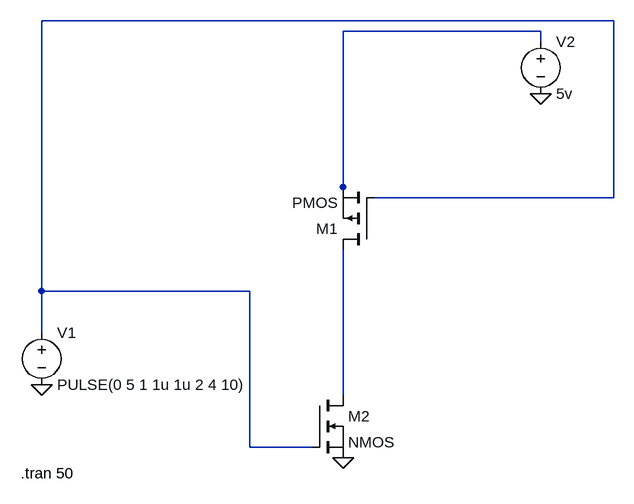
[diagram p0: schematic Cmoc_invert.asc]
Cmoc_invert.asc, the LTspice schematic file:
Version 4
SHEET 1 880 680
WIRE 400 -144 -480 -144
WIRE 288 -128 -16 -128
WIRE 288 -112 288 -128
WIRE -16 112 -16 -128
WIRE -16 128 -16 112
WIRE 400 128 400 -144
WIRE 400 128 32 128
WIRE -480 272 -480 -144
WIRE -160 272 -480 272
WIRE -480 336 -480 272
WIRE -16 432 -16 208
WIRE -160 512 -160 272
WIRE -64 512 -160 512
FLAG -480 416 0
FLAG 288 -32 0
FLAG -16 528 0
SYMBOL nmos -64 432 R0
SYMATTR InstName M2
SYMBOL voltage -480 320 R0
WINDOW 123 0 0 Left 0
WINDOW 39 0 0 Left 0
SYMATTR InstName V1
SYMATTR Value PULSE(0 5 1 1u 1u 2 4 10)
SYMBOL voltage 288 -128 R0
WINDOW 123 0 0 Left 0
WINDOW 39 0 0 Left 0
SYMATTR InstName V2
SYMATTR Value 5v
SYMBOL pmos 32 208 R180
SYMATTR InstName M1
TEXT -512 552 Left 2 !.tran 50

The netlist it stands for:
* Cmoc_invert.asc
M2 N003 N001 0 0 NMOS
V1 N001 0 PULSE(0 5 1 1u 1u 2 4 10)
V2 N002 0 5v
M1 N003 N001 N002 N002 PMOS
.model NMOS NMOS
.model PMOS PMOS
.lib standard.mos
.tran 50
.backanno
.end